# EAGLE design Thermostat (EAGLE 6.4)
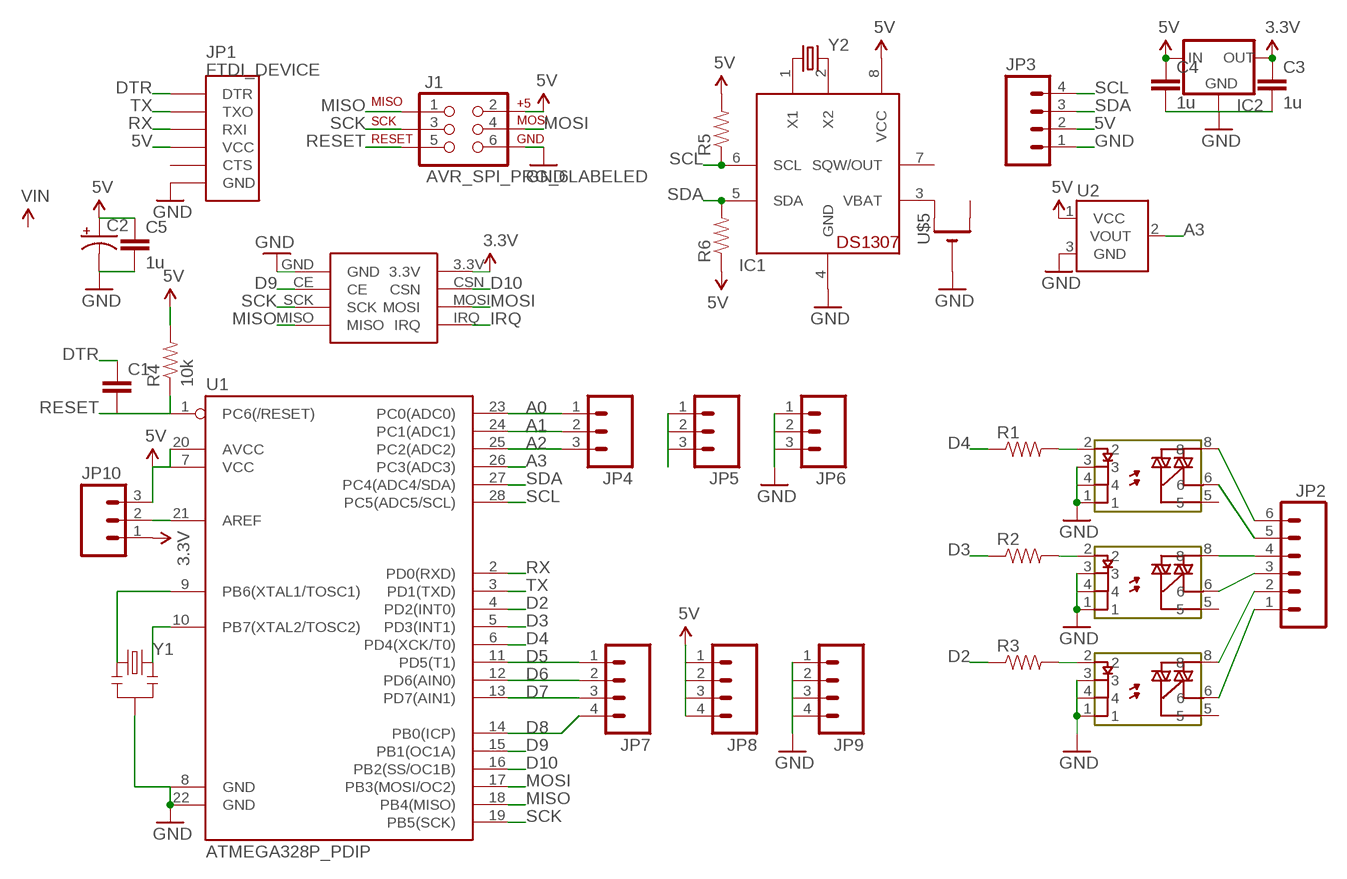
[diagram p0: schematic, sheet 1]

## Parts
C1  CAPPTH  [CAP-PTH-SMALL]
C2  CAP_POLPTH1  [CPOL-RADIAL-100UF-25V]
C3  1u  CAPPTH  [CAP-PTH-SMALL]
C4  1u  CAPPTH  [CAP-PTH-SMALL]
C5  1u  CAPPTH  [CAP-PTH-SMALL]
IC1  DS1307  [DIL08]
IC2  MCP1700INLINE  [TO92-INLINE]
J1  AVR_SPI_PRG_6LABELED  [2X3-NS]
JP1  FTDI_DEVICE  [FTDI_DEVICE_SIDE]
JP2  M063.5MM-6  [SCREWTERMINAL-3.5MM-6]
JP3  M04PTH  [1X04]
JP4  M03PTH  [1X03]
JP5  M03PTH  [1X03]
JP6  M03PTH  [1X03]
JP7  M04PTH  [1X04]
JP8  M04PTH  [1X04]
JP9  M04PTH  [1X04]
JP10  M03PTH  [1X03]
R1  RESISTORAXIAL-0.3  [AXIAL-0.3]
R2  RESISTORAXIAL-0.3  [AXIAL-0.3]
R3  RESISTORAXIAL-0.3  [AXIAL-0.3]
R4  10k  RESISTORAXIAL-0.3  [AXIAL-0.3]
R5  RESISTORAXIAL-0.3  [AXIAL-0.3]
R6  RESISTORAXIAL-0.3  [AXIAL-0.3]
U1  ATMEGA328P_PDIP  [DIL28-3]
U2  TMP36GT9  [TO-92]
U$1  PR39MF5  [PR39MF51]
U$2  PR39MF5  [PR39MF51]
U$3  PR39MF5  [PR39MF51]
U$4  RF24_MODULE  [RF24_SOCKET]
U$5  CR1220THM  [CR1220-THM]
Y1  RESONATORPTH  [RESONATOR-PTH]
Y2  CRYSTALTC26H  [TC26H]

## Nets
3.3V: C3.1 IC2.3(OUT) JP10.1 U$4.3.3V
5V: C2.1(+) C4.1 C5.1 IC1.8(VCC) IC2.2(IN) J1.2 JP1.P$4(VCC) JP3.2 JP8.1 JP8.2 JP8.3 JP8.4 JP10.3 R4.P$2 R5.P$2 R6.P$1 U1.7(VCC) U1.20(AVCC) U2.1(VCC)
A0: JP4.1 U1.23(PC0(ADC0))
A1: JP4.2 U1.24(PC1(ADC1))
A2: JP4.3 U1.25(PC2(ADC2))
A3: U1.26(PC3(ADC3)) U2.2(VOUT)
AREF: JP5.1 JP5.2 JP5.3 JP10.2 U1.21(AREF)
D2: R3.P$1 U1.4(PD2(INT0))
D3: R2.P$1 U1.5(PD3(INT1))
D4: R1.P$1 U1.6(PD4(XCK/T0))
D5: JP7.1 U1.11(PD5(T1))
D6: JP7.2 U1.12(PD6(AIN0))
D7: JP7.3 U1.13(PD7(AIN1))
D8: JP7.4 U1.14(PB0(ICP))
D9: U1.15(PB1(OC1A)) U$4.CE
D10: U1.16(PB2(SS/OC1B)) U$4.CSN
DTR: C1.1 JP1.P$1(DTR)
GND: C2.2(-) C3.2 C4.2 C5.2 IC1.4(GND) IC2.1(GND) J1.6 JP1.P$6(GND) JP3.1 JP6.1 JP6.2 JP6.3 JP9.1 JP9.2 JP9.3 JP9.4 U1.8(GND) U1.22(GND) U2.3(GND) U$1.1 U$1.3 U$1.4 U$2.1 U$2.3 U$2.4 U$3.1 U$3.3 U$3.4 U$4.GND U$5.- Y1.2
IRQ: U$4.IRQ
MISO: J1.1 U1.18(PB4(MISO)) U$4.MISO
MOSI: J1.4 U1.17(PB3(MOSI/OC2)) U$4.MOSI
N$1: JP2.6 U$1.8
N$2: R1.P$2 U$1.2
N$3: JP2.5 U$1.6
N$4: JP2.4 U$2.8
N$5: JP2.3 U$2.6
N$6: JP2.2 U$3.8
N$7: R2.P$2 U$2.2
N$8: JP2.1 U$3.6
N$9: IC1.2(X2) Y2.2
N$10: R3.P$2 U$3.2
N$11: IC1.1(X1) Y2.1
N$12: IC1.3(VBAT) U$5.+1(+)
N$32: U1.9(PB6(XTAL1/TOSC1)) Y1.1
N$33: U1.10(PB7(XTAL2/TOSC2)) Y1.3
RESET: C1.2 J1.5 R4.P$1 U1.1(PC6(/RESET))
RX: JP1.P$3(RXI) U1.2(PD0(RXD))
SCK: J1.3 U1.19(PB5(SCK)) U$4.SCK
SCL: IC1.6(SCL) JP3.4 R5.P$1 U1.28(PC5(ADC5/SCL))
SDA: IC1.5(SDA) JP3.3 R6.P$2 U1.27(PC4(ADC4/SDA))
TX: JP1.P$2(TXO) U1.3(PD1(TXD))
Unconnected: IC1.7(SQW/OUT) JP1.P$5(CTS) U$1.5 U$2.5 U$3.5 U$5.+2(+1)

## Library data of the parts
C1 C3-C5 = SparkFun-Capacitors:CAP: Capacitor Standard 0603 ceramic capacitor, and 0.1" leaded capacitor.
C2 = SparkFun-Capacitors:CAP_POL: Capacitor Polarized These are standard SMD and PTH capacitors. Normally 10uF, 47uF, and 100uF in electrolytic and tantalum varieties. Always verify the external diameter of the through hole cap, it varies with capacity, voltage, and manufacturer. The EIA devices should be standard.
IC1 = adafruit:DS1307: DS1307 Real time clock (RTC) with battery backup ability. Talk to it via i2c
IC2 = adafruit:MCP1700: VOLTAGE REGULATOR
J1 = barbary_enterprises:AVR_SPI_PRG_6: AVR ISP 6 Pin This is the reduced ISP connector for AVR programming. Common on Arduino. This footprint will take up less PCB space and can be used with a 10-pin to 6-pin adapter such as SKU: BOB-08508
JP1 = SparkFun-Connectors:FTDI_DEVICE: Connector which mates to FTDI basic or FTDI cable.
JP2 = SparkFun-Connectors:M06: Header 6 Standard 6-pin 0.1" header. Use with straight break away headers (SKU : PRT-00116), right angle break away headers (PRT-00553), swiss pins (PRT-00743), machine pins (PRT-00117), and female headers (PRT-00115). Molex polarized connector foot print use with SKU : PRT-08094 with associated crimp pins and housings. NOTES ON THE VARIANTS LOCK and LOCK_LONGPADS... This footprint was designed to help hold the alignment of a through-hole component (i.e. 6-pin header) while soldering it into place. You may notice that each hole has been shifted either up or down by 0.005 of an inch from it's more standard position (which is a perfectly straight line). This slight alteration caused the pins (the squares in the middle) to touch the edges of the holes. Because they are alternating, it causes a "brace" to hold the component in place. 0.005 has proven to be the perfect amount of "off-center" position when using our standard breakaway headers. Although looks a little odd when you look at the bare footprint, once you have a header in there, the alteration is very hard to notice. Also,if you push a header all the way into place, it is covered up entirely on the bottom side. This idea of altering the position of holes to aid alignment will be further integrated into the Sparkfun Library for other footprints. It can help hold any component with 3 or more connection pins.
JP3 JP7-JP9 = SparkFun-Connectors:M04: Header 4 Standard 4-pin 0.1" header. Use with straight break away headers (SKU : PRT-00116), right angle break away headers (PRT-00553), swiss pins (PRT-00743), machine pins (PRT-00117), and female headers (PRT-00115). Molex polarized connector foot print use with SKU : PRT-08231 with associated crimp pins and housings. 1MM SMD Version SKU: PRT-10208
JP4-JP6 JP10 = SparkFun-Connectors:M03: Header 3 Standard 3-pin 0.1" header. Use with straight break away headers (SKU : PRT-00116), right angle break away headers (PRT-00553), swiss pins (PRT-00743), machine pins (PRT-00117), and female headers (PRT-00115). Molex polarized connector foot print use with SKU : PRT-08232 with associated crimp pins and housings.
R1-R6 = SparkFun-Resistors:RESISTOR: Resistor Basic schematic elements and footprints for 0603, 1206, and PTH resistors.
U1 = SparkFun-DigitalIC:ATMEGA328P_PDIP: uC used in the Arduino 32kb flash, 1k EEPROM, 2k SRAM This is the through-hole version of this chip.
U2 = SparkFun-Sensors:TMP36: Precision degC temp sensor, analog out
U$1-U$3 = barbary_enterprises:PR39MF5
U$4 = barbary_enterprises:RF24_MODULE: nRF24L01 2.4GHz Radio/Wireless Transceivers These are a series of 2.4 GHz Radio modules that are all based on the Nordic Semiconductor nRF24L01+ chip. (Details) The Nordic nRF24L01+ integrates a complete 2.4GHz RF transceiver, RF synthesizer, and baseband logic including the Enhanced ShockBurst™ hardware protocol accelerator supporting a high-speed SPI interface for the application controller.
U$5 = adafruit:CR1220: CR1216/CR1220/CR1225 12mm 3V lithium coin cell Great for battery packup. Both SMT and THM holders. Note the THM package has the ground pads on both sides of the PCB so that the masks are the same - this reduces the cost
Y1 = SparkFun-FreqCtrl:RESONATOR: Resonator Small SMD resonator. Used, eg, on the Arduino Pro/ Pro Mini boards. 8MHz- XTAL-08895 16MHz- XTAL-08900
Y2 = SparkFun-FreqCtrl:CRYSTAL: Various standard crystals. Proven footprints. Spark Fun Electronics SKU : COM-00534

## Board
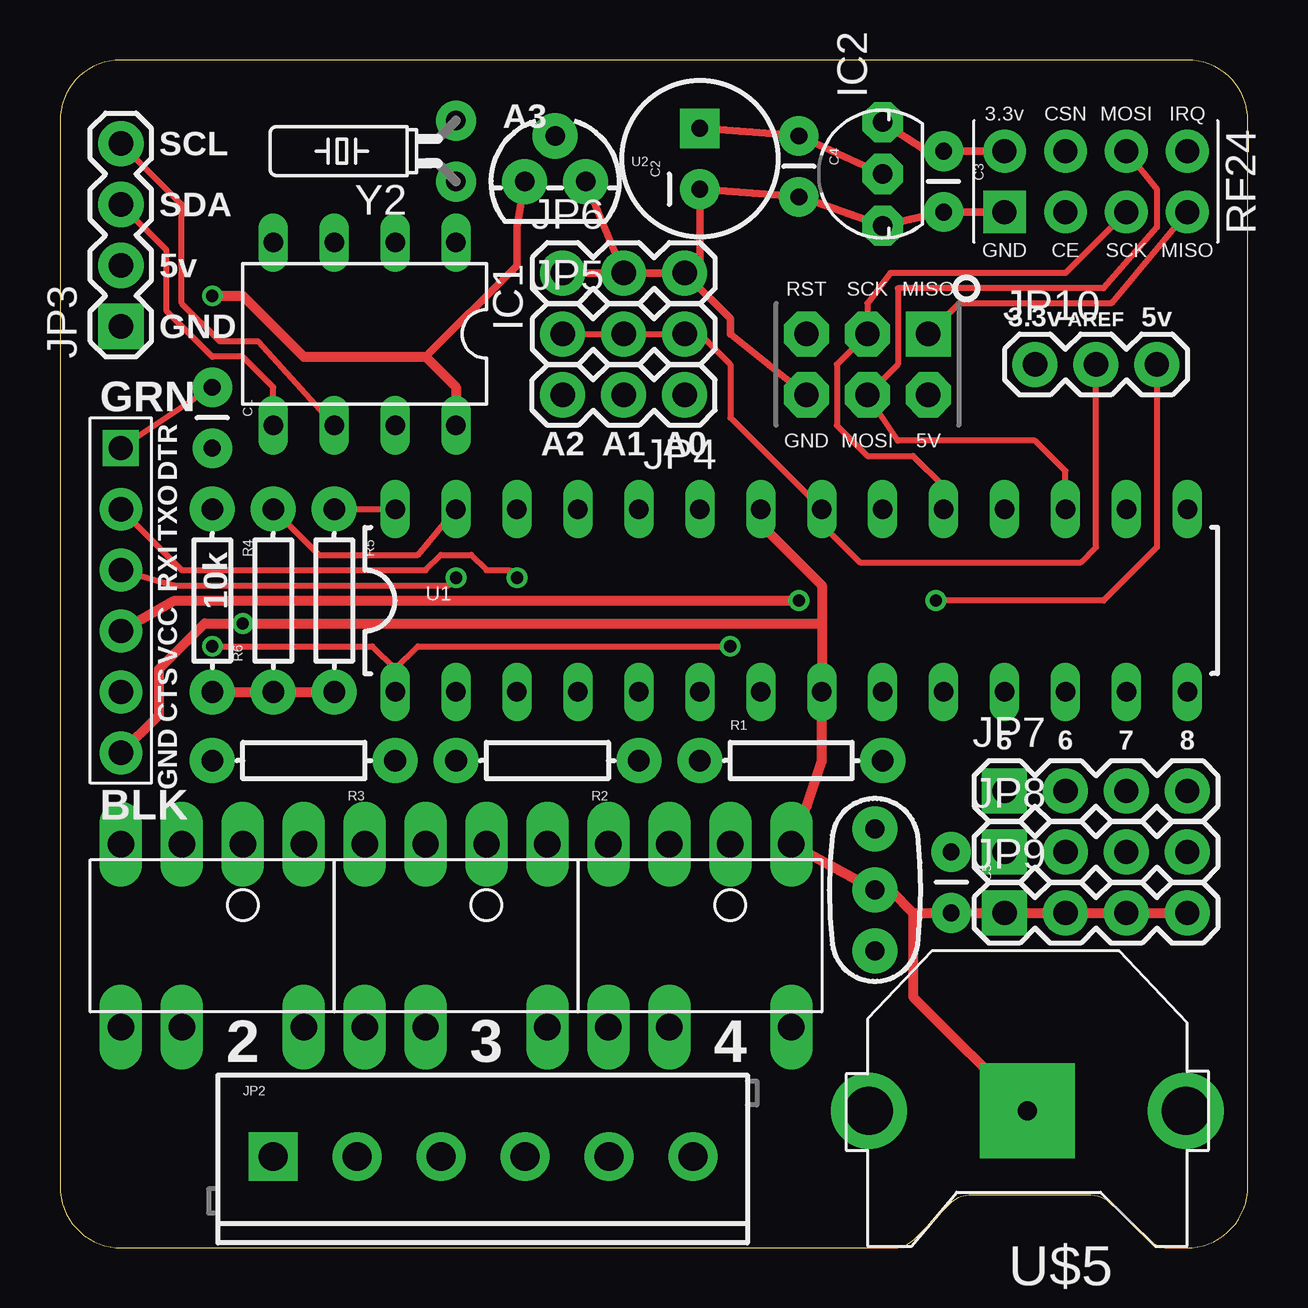
[diagram p1: board, top side]
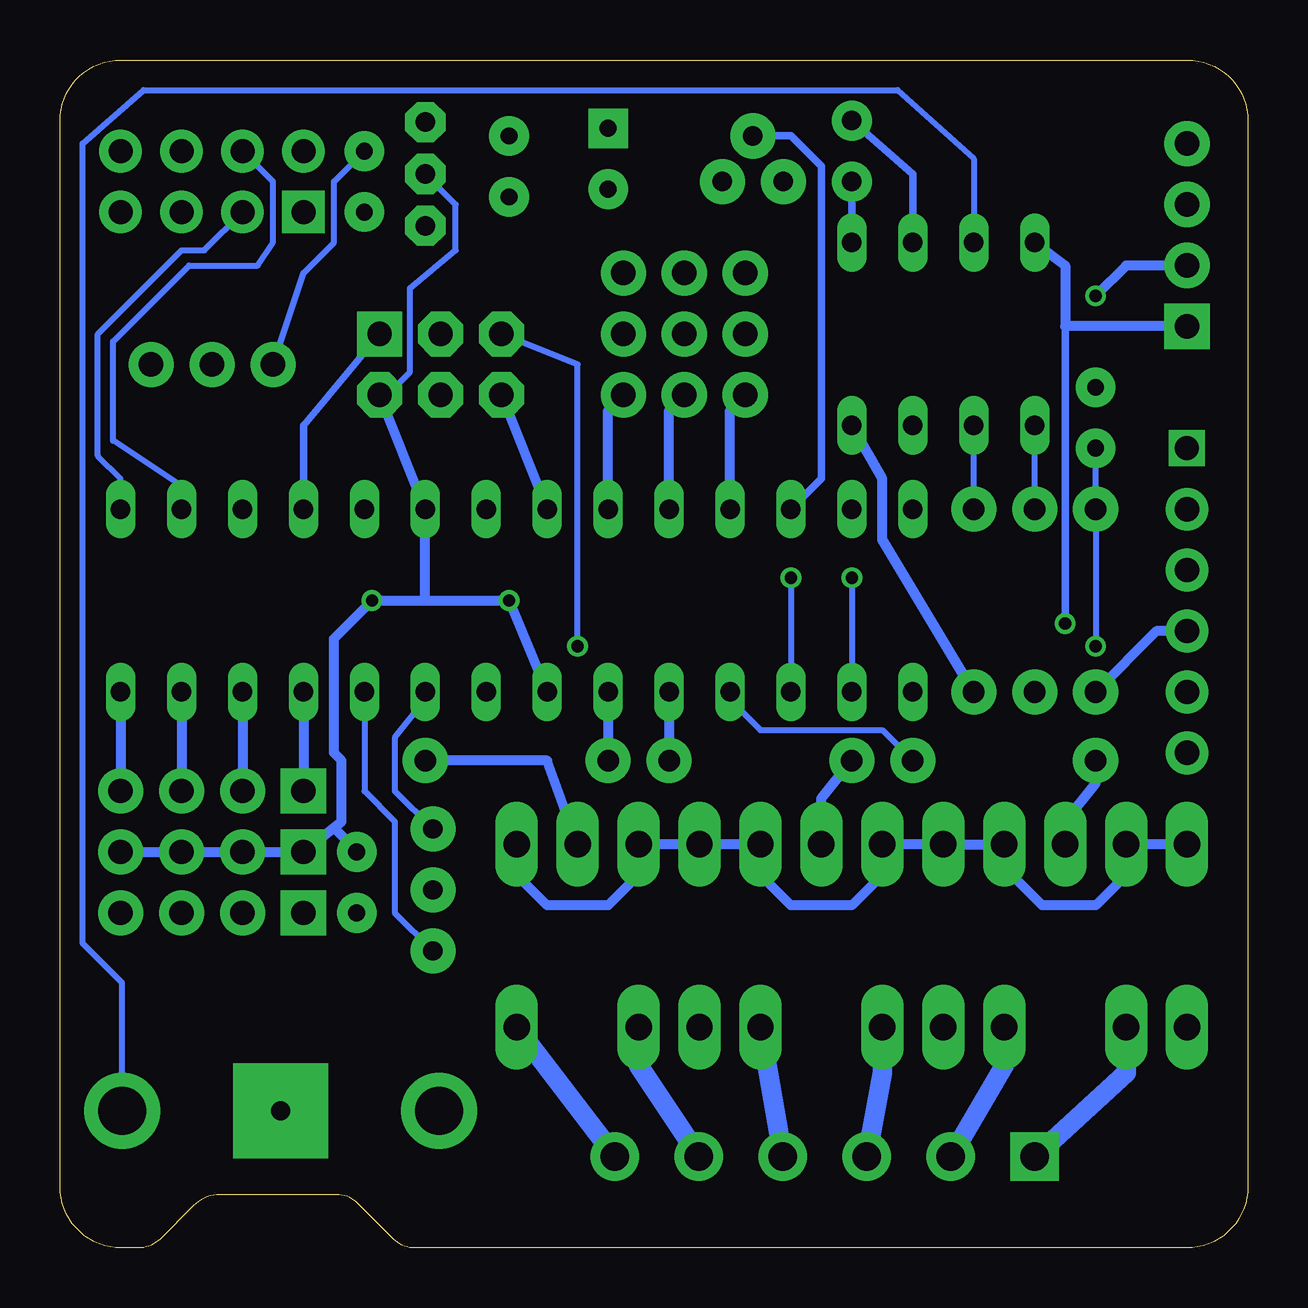
[diagram p2: board, bottom side, seen from below]

Size 49.52 x 49.52 mm. Coordinates in mm from the lower left corner, seen from the top.
Outline: 0,46.98 0,2.56 arc90 2.56,0 34.72,0 arc45 35.61,0.37 37.09,1.85 arc-45 37.99,2.22 42.84,2.22 arc-45 43.96,1.76 45.35,0.37 arc45 46.25,0 46.96,0 arc90 49.52,2.56 49.52,46.99 arc90 46.99,49.52 2.54,49.52 arc90 0,46.98
Copper layers (1*16): Top 0.0356mm / dielectric 1.5011mm / Bottom 0.0356mm
Design rules "LaenPCBOrder": minimum track width 6mil, minimum drill 13mil, track to track 6mil, track to pad 6mil, pad to pad 6mil, via to via 6mil, smd to smd 6mil, copper to edge 15mil, drill to drill 6mil, minimum pad ring 7mil, minimum via ring 7mil, stop-mask expansion 3mil, vias tented up to drill 0mil, thermal gap 10mil

### Footprints (pad centres in the part's own frame; a part is rotated, then mirrored left to right if it is on the bottom)
CAP-PTH-SMALL = drill 0.7 pad 1.651: 1 0,0; 2 2.54,0
CPOL-RADIAL-100UF-25V = drill 0.7 pad 1.651 square: 1 1.27,0 | drill 0.7 pad 1.651: 2 -1.27,0
DIL08 = drill 0.813 long: 1 -3.81,-3.81; 2 -1.27,-3.81; 3 1.27,-3.81; 4 3.81,-3.81; 5 3.81,3.81; 6 1.27,3.81; 7 -1.27,3.81; 8 -3.81,3.81
TO92-INLINE = drill 0.813 pad 1.676 octagon: 1 -2.159,0; 2 0,0; 3 2.159,0
2X3-NS = drill 1.016 pad 1.88 square: 1 -2.54,-1.27 | drill 1.016 pad 1.88 octagon: 2 -2.54,1.27; 3 0,-1.27; 4 0,1.27; 5 2.54,-1.27; 6 2.54,1.27
FTDI_DEVICE_SIDE = drill 1 square: P$1 -6.35,0 | drill 1.016 pad 1.778: P$2 -3.81,0; P$3 -1.27,0; P$4 1.27,0; P$5 3.81,0; P$6 6.35,0
SCREWTERMINAL-3.5MM-6 = drill 1.2 pad 2.032 square: 1 0,0 | drill 1.2 pad 2.032: 2 3.5,0; 3 7,0; 4 10.5,0; 5 14,0; 6 17.5,0
1X04 = drill 1.016 pad 1.88 square: 1 0,0 | drill 1.016 pad 1.88: 2 2.54,0; 3 5.08,0; 4 7.62,0
1X03 = drill 1.016 pad 1.88: 1 0,0; 2 2.54,0; 3 5.08,0
AXIAL-0.3 = drill 0.9 pad 1.88: P$1 -3.81,0; P$2 3.81,0
DIL28-3 = drill 0.813 long: 1 -16.51,-3.81; 2 -13.97,-3.81; 3 -11.43,-3.81; 4 -8.89,-3.81; 5 -6.35,-3.81; 6 -3.81,-3.81; 7 -1.27,-3.81; 8 1.27,-3.81; 9 3.81,-3.81; 10 6.35,-3.81; 11 8.89,-3.81; 12 11.43,-3.81; 13 13.97,-3.81; 14 16.51,-3.81; 15 16.51,3.81; 16 13.97,3.81; 17 11.43,3.81; 18 8.89,3.81; 19 6.35,3.81; 20 3.81,3.81; 21 1.27,3.81; 22 -1.27,3.81; 23 -3.81,3.81; 24 -6.35,3.81; 25 -8.89,3.81; 26 -11.43,3.81; 27 -13.97,3.81; 28 -16.51,3.81
TO-92 = drill 0.813 pad 1.88: 1 -1.27,0; 2 0,1.905; 3 1.27,0
PR39MF51 = drill 1.1 pad 1.778 long: 1 -2.54,2.54; 2 -2.54,0; 3 -2.54,-2.54; 4 -2.54,-5.08; 5 5.08,-5.08; 6 5.08,-2.54; 8 5.08,2.54
RF24_SOCKET = drill 1 pad 1.778: 3.3V 1.27,3.81; CE -1.27,1.27; CSN 1.27,1.27; IRQ 1.27,-3.81; MISO -1.27,-3.81; MOSI 1.27,-1.27; SCK -1.27,-1.27 | drill 1 pad 1.778 square: GND -1.27,3.81
CR1220-THM = drill 2 pad 3.175: +1 -6.604,0; +2 6.604,0 | drill 0.8 pad 3.962 square: - 0,0
RESONATOR-PTH = drill 0.8 pad 1.88: 1 -2.54,0; 2 0,0; 3 2.54,0
TC26H = drill 0.813 pad 1.676: 1 -1.27,0; 2 1.27,0

### Placement (x,y rotation side)
C1  6.35,35.88 270 top
C2  26.67,45.4 90 top
C3  36.83,45.72 270 top
C4  30.8,46.35 270 top
C5  37.15,16.51 270 top
IC1  12.7,38.1 180 top
IC2  34.29,44.77 90 top
J1  33.66,36.83 180 top
JP1  2.54,26.99 270 top
JP2  8.89,3.81 0 top
JP3  2.54,38.42 90 top
JP4  26.04,35.56 180 top
JP5  20.95,38.1 0 top
JP6  20.95,40.64 0 top
JP7  39.37,19.05 0 top
JP8  39.37,16.51 0 top
JP9  39.37,13.97 0 top
JP10  40.64,36.83 0 top
R1  30.48,20.32 0 top
R2  20.32,20.32 180 top
R3  10.16,20.32 180 top
R4  6.35,26.99 270 top
R5  11.43,26.99 270 top
R6  8.89,26.99 90 top
U1  30.48,26.99 0 top
U2  20.64,44.45 0 top
U$1  27.94,14.29 270 top
U$2  17.78,14.29 270 top
U$3  7.62,14.29 270 top
U$4  43.18,44.45 90 top
U$5  40.32,5.71 180 top
Y1  33.97,14.92 270 top
Y2  16.51,45.72 90 top

### Tracks (layer width: path | path; a pad name or v marks a point on that pad's centre or on a via)
3.3V
  Top 0.305: U$4.3.3V C3.1 36.13,45.72 IC2.3
  Bottom 0.254: JP10.1 39.37,40.64 38.1,41.91 38.1,44.45 C3.1
5V  (via drill 0.51)
  Top 0.254: JP10.3 45.72,29.21 43.5,26.99 v36.51,26.99
  Top 0.305: U2.1 19.05,42.55 19.05,40.96 15.24,37.15 | IC2.2 C4.1 C2.1
  Top 0.406: JP1.P$4 4.76,26.99 v30.8,26.99 | R4.P$2 R6.P$1 R5.P$2 | v6.35,39.69 7.62,39.69 10.16,37.15 15.24,37.15 16.51,35.88 IC1.8
  Bottom 0.152: 37.95,17.37 38.1,17.37 38.17,17.47 | 37.19,16.61 C5.1
  Bottom 0.254: J1.2 35.88,35.56 34.92,36.51 34.92,40.01 33.02,41.59 33.02,43.5 IC2.2
  Bottom 0.406: JP1.P$4 3.81,25.72 R4.P$2 | 34.29,26.99 U1.20 J1.2 | U1.7 v30.8,26.99 34.29,26.99 | R5.P$2 15.24,29.53 15.24,32.07 IC1.8 | JP3.2 5.08,40.96 v6.35,39.69 | JP8.4 JP8.3 JP8.2 JP8.1 38.17,17.47 37.78,17.78 37.78,20.32 38.1,20.64 38.1,25.4 v36.51,26.99 34.29,26.99 | 37.95,17.37 37.19,16.61
A0
  Bottom 0.406: U1.23 26.67,34.92 JP4.1
A1
  Bottom 0.406: U1.24 24.13,34.92 JP4.2
A2
  Bottom 0.406: U1.25 21.59,34.92 JP4.3
A3
  Bottom 0.305: U1.26 17.78,32.07 17.78,45.09 19.05,46.35 U2.2
AREF
  Top 0.254: JP5.1 JP5.2 JP5.3 26.67,38.1 27.94,36.83 27.94,34.61 U1.21 31.75,30.16 33.34,28.57 42.55,28.57 43.18,29.21 JP10.2
D2
  Bottom 0.254: U1.4 21.59,22.86 20.32,21.59 15.24,21.59 R3.P$1
D3
  Bottom 0.406: U1.5 R2.P$1
D4
  Bottom 0.406: U1.6 R1.P$1
D5
  Bottom 0.406: U1.11 JP7.1
D6
  Bottom 0.406: U1.12 JP7.2
D7
  Bottom 0.406: U1.13 JP7.3
D8
  Bottom 0.406: U1.14 JP7.4
D9
  Bottom 0.254: U1.15 46.99,32.07 47.94,33.02 47.94,38.1 44.45,41.59 43.5,41.59 U$4.CE
D10
  Bottom 0.254: U1.16 44.45,31.75 47.31,33.66 47.31,37.78 44.13,40.96 41.27,40.96 40.64,41.91 40.64,44.45 U$4.CSN
DTR
  Top 0.254: C1.1 JP1.P$1
GND  (via drill 0.51)
  Top 0.152: C4.2 30.79,43.89 30.78,43.82 | 36.77,43.18 36.88,43.13 C3.2 | C5.2 37.19,14.02 37.19,13.97
  Top 0.305: J1.6 27.94,38.1 27.94,38.73 JP6.3 | JP6.3 JP6.2 | JP6.2 JP6.1 | U2.3 JP6.2 | JP6.3 26.67,40.64 C2.2 30.78,43.82 30.86,43.81 IC2.1 36.77,43.18 C3.2 U$4.GND
  Top 0.406: JP1.P$6 4.13,22.23 4.13,24.13 6.03,26.04 v7.62,26.04 31.75,26.04 | 31.75,26.04 U1.8 31.75,20.32 31.11,18.41 U$1.1 Y1.2 34.61,14.92 35.56,13.97 | 29.21,30.16 31.75,27.62 31.75,26.04 | 35.56,13.97 35.56,10.48 U$5.- | 35.56,13.97 C5.2 37.19,13.97 JP9.1 JP9.2 JP9.3 JP9.4
  Top 0.61: U1.22 29.21,30.16
  Bottom 0.305: 7.62,38.42 v7.62,26.04
  Bottom 0.406: U$3.4 U$3.3 5.08,15.56 6.35,14.29 8.57,14.29 9.84,15.56 U$3.1 U$2.4 U$2.3 15.24,15.56 16.51,14.29 19.05,14.29 20.32,15.56 U$2.1 U$1.4 U$1.3 25.4,15.56 26.67,14.29 29.21,14.29 30.48,15.56 U$1.1 | IC1.4 7.62,40.96 7.62,38.42 JP3.1 | J1.6 U1.22
MISO
  Top 0.254: U$4.MISO 43.81,39.37 37.47,39.37 J1.1
  Bottom 0.305: U1.18 39.37,34.29 J1.1
MOSI
  Top 0.254: U1.17 41.91,32.38 40.64,33.66 34.92,33.66 J1.4 34.92,36.83 34.92,40.01 43.5,40.01 45.72,42.55 45.72,44.13 U$4.MOSI
N$1
  Bottom 0.813: U$1.8 26.35,3.81 JP2.6
N$2
  Bottom 0.406: U$1.2 29.21,20.32 R1.P$2
N$3
  Bottom 0.813: U$1.6 25.4,7.62 22.86,3.81 JP2.5
N$4
  Bottom 0.813: U$2.8 JP2.4
N$5
  Bottom 0.813: U$2.6 15.24,7.3 JP2.3
N$6
  Bottom 0.813: U$3.8 10.16,7.62 JP2.2
N$7
  Bottom 0.406: U$2.2 17.78,18.73 R2.P$2
N$8
  Bottom 0.813: U$3.6 5.08,7.3 JP2.1
N$9
  Bottom 0.305: Y2.2 13.97,44.77 IC1.2
N$10
  Bottom 0.406: U$3.2 7.62,17.78 6.35,19.37 R3.P$2
N$11
  Bottom 0.305: Y2.1 IC1.1
N$12
  Bottom 0.254: U$5.+1 46.93,11.05 48.58,12.7 48.58,46.04 46.04,48.26 14.61,48.26 11.43,45.4 IC1.3
N$32
  Bottom 0.254: U1.9 34.29,22.86 35.56,21.27 35.56,19.05 Y1.1
N$33
  Bottom 0.254: U1.10 36.83,19.05 35.56,17.78 35.56,13.97 Y1.3
RESET  (via drill 0.51)
  Top 0.254: v6.35,25.08 13.02,25.08 13.97,24.13 | 13.97,24.13 U1.1 | 13.97,24.13 14.92,25.08 v27.94,25.08
  Bottom 0.254: C1.2 R4.P$1 v6.35,25.08 | v27.94,25.08 27.94,36.83 J1.5
RX  (via drill 0.51)
  Top 0.254: JP1.P$3 4.76,27.62 16.19,27.62 v16.51,27.94
  Bottom 0.254: v16.51,27.94 U1.2
SCK
  Top 0.254: U1.19 36.83,31.75 35.56,33.02 33.66,33.02 32.38,34.29 32.38,36.83 J1.3 33.66,39.37 34.61,40.64 41.91,40.64 U$4.SCK
SCL
  Top 0.254: R5.P$1 U1.28 | IC1.6 8.26,37.78 6.67,37.78 5.08,39.37 5.08,43.5 JP3.4
  Bottom 0.254: R5.P$1 IC1.6
SDA
  Top 0.254: R6.P$2 10.79,28.89 14.92,28.89 U1.27 | IC1.5 8.89,35.88 7.62,37.15 6.35,37.15 4.45,39.05 4.45,41.59 JP3.3
  Bottom 0.254: R6.P$2 IC1.5
TX  (via drill 0.51)
  Top 0.254: JP1.P$2 5.08,28.26 15.24,28.26 15.88,28.89 17.14,28.89 17.78,28.26 18.73,28.26 v19.05,27.94
  Bottom 0.254: v19.05,27.94 U1.3

### Text on the board
tPlace: A3 | SCL | SDA | 5v | GND | 3.3v | AREF | 5v | A2 | A1 | A0 | 5 | 6 | 7 | 8 | 2 | 3 | 4